# Altium schematic sheet TP1_NodoWiFi_Cpu0_Rev0.SchDoc: TP1 NodoWiFi Cpu0 Rev0
size A4; Author: Alejandro Darío Sobral; SheetNumber: 4; SheetTotal: 5
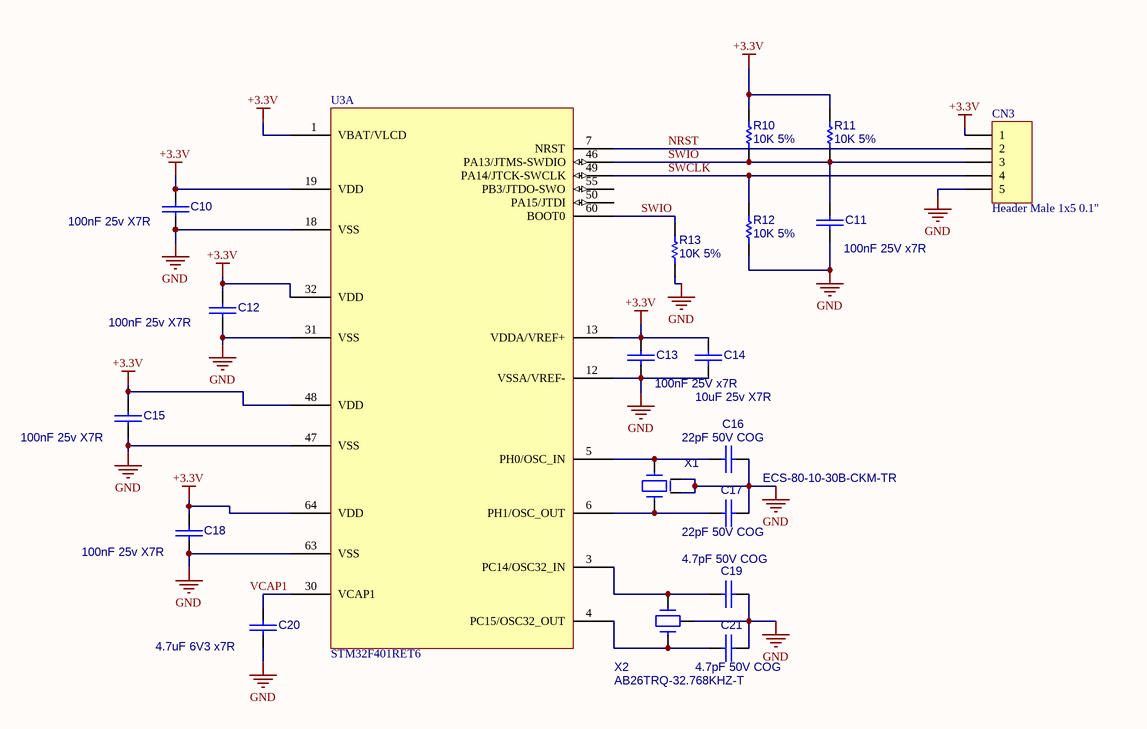
[diagram p0: TP1_NodoWiFi_Cpu0_Rev0.SchDoc]

## Parts
C10  100nF 25v X7R  [C_0805]
C11  100nF 25V x7R  [C_0805]
C12  100nF 25v X7R  [C_0805]
C13  100nF 25V x7R  [C_0805]
C14  10uF 25v X7R  [C_0805]
C15  100nF 25v X7R  [C_0805]
C16  22pF 50V COG  [C_0805]
C17  22pF 50V COG  [C_0805]
C18  100nF 25v X7R  [C_0805]
C19  4.7pF 50V COG  [C_0805]
C20  4.7uF 6V3 x7R  [C_0805]
C21  4.7pF 50V COG  [C_0805]
CN3  Header Male 1x5 0.1"  [Header_M_1x5_0.1"]
R10  10K 5%  [R_0805]
R11  10K 5%  [R_0805]
R12  10K 5%  [R_0805]
R13  10K 5%  [R_0805]
U3  STM32F401RET6  [LQFP_64]  (part A of 2)
X1  ECS-80-10-30B-CKM-TR  [ABM3C]
X2  AB26TRQ-32.768KHZ-T  [AB26TQF]

## Nets
+3.3V: C10.1 C12.1 C13.1 C14.1 C15.1 C18.1 CN3.1 R10.2 R11.2 U3.1(VBAT/VLCD) U3.13(VDDA/VREF+) U3.19(VDD) U3.32(VDD) U3.48(VDD) U3.64(VDD)
GND: C10.2 C11.2 C12.2 C13.2 C14.2 C15.2 C16.2 C17.2 C18.2 C19.2 C20.2 C21.2 CN3.5 R12.1 R13.1 U3.12(VSSA/VREF-) U3.18(VSS) U3.31(VSS) U3.47(VSS) U3.63(VSS) X1.2 X1.4 X2.3
NRST: CN3.2 U3.7(NRST)
SWCLK: CN3.4 R12.2 U3.49(PA14/JTCK-SWCLK)
SWIO: C11.1 CN3.3 R10.1 R11.1 R13.2 U3.46(PA13/JTMS-SWDIO) U3.60(BOOT0)
NetC16_1: C16.1 U3.5(PH0/OSC_IN) X1.1
NetC17_1: C17.1 U3.6(PH1/OSC_OUT) X1.3
NetC19_1: C19.1 U3.3(PC14/OSC32_IN) X2.2
NetC20_1: C20.1 U3.30(VCAP1)
NetC21_1: C21.1 U3.4(PC15/OSC32_OUT) X2.1

Not connected (* = marked no-connect by the designer): U3 50(PA15/JTDI) 55(PB3/JTDO-SWO)

## Notes on the sheet
- Labels drawn without touching a wire or pin: VCAP1
- Title:
- Size:
- Author:
- A4
- Sheet
- of
- Revision:
- File:
- Date:

## Library data of the parts
C10 C12 C15 C18 = CAP
C11 C13 C14 C16 C17 C19 C21 = CAP: Non Polarized Capacitor
C20 = CAP: 100nF 25v X7R
CN3 = CONN_05P: Connector Generic 5 Vias
R10-R13 = Res1: Resistor
U3 = STM32F401RE
X1 = CRYSTAL_4P: Crystal 4 Vias + GND
X2 = CRYSTAL 3P: Crystal 2 Vias + GND